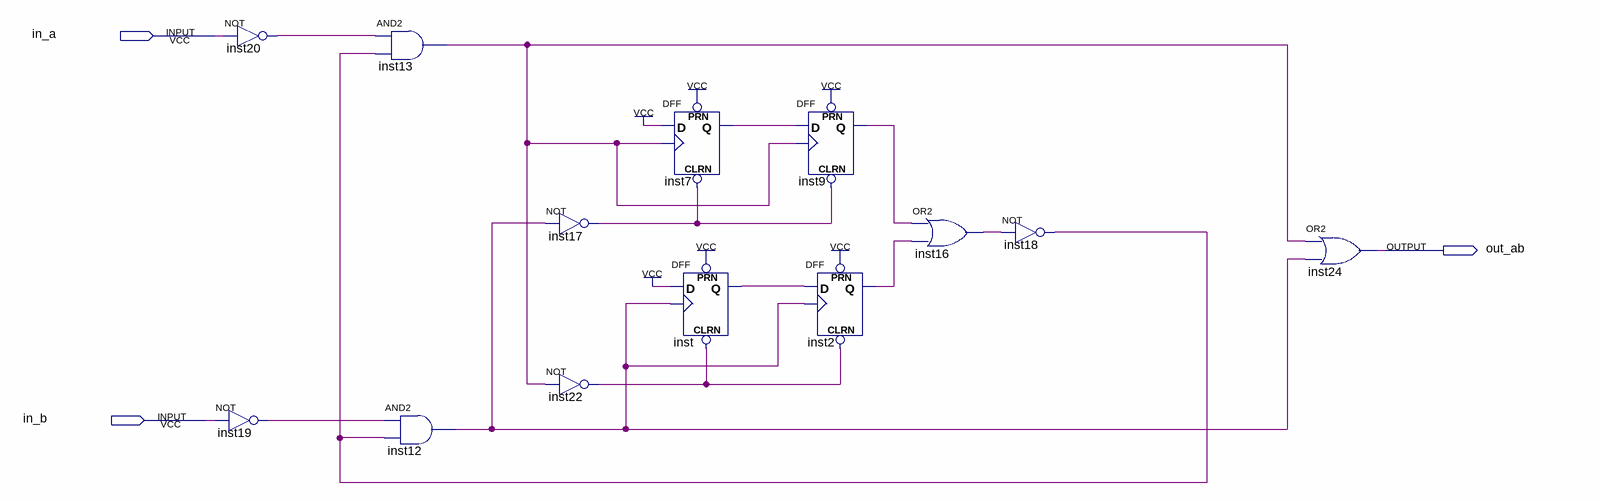
[diagram p0: schematic sheet]
// Quartus schematic sig_in_m.bdf as structural Verilog: 13 symbols, 3 pins
module sig_in_m (
  input  in_a,
  input  in_b,
  output out_ab
);

  wire inst2_q, inst7_q, inst9_q, inst12_out, inst13_out, inst16_out, inst17_out, inst18_out, inst19_out,
       inst20_out, inst22_out, inst_q;

  not inst20 (inst20_out, in_a);
  not inst19 (inst19_out, in_b);
  and inst13 (inst13_out, inst20_out, inst18_out);
  and inst12 (inst12_out, inst19_out, inst18_out);
  not inst17 (inst17_out, inst12_out);
  not inst22 (inst22_out, inst13_out);
  DFF inst7 (.CLRN(inst17_out), .CLK(inst13_out), .D(1'b1), .PRN(1'b1), .Q(inst7_q));
  DFF inst (.CLRN(inst22_out), .CLK(inst12_out), .D(1'b1), .PRN(1'b1), .Q(inst_q));
  DFF inst9 (.CLRN(inst17_out), .CLK(inst13_out), .D(inst7_q), .PRN(1'b1), .Q(inst9_q));
  DFF inst2 (.CLRN(inst22_out), .CLK(inst12_out), .D(inst_q), .PRN(1'b1), .Q(inst2_q));
  or inst16 (inst16_out, inst9_q, inst2_q);
  not inst18 (inst18_out, inst16_out);
  or inst24 (out_ab, inst13_out, inst12_out);
endmodule
